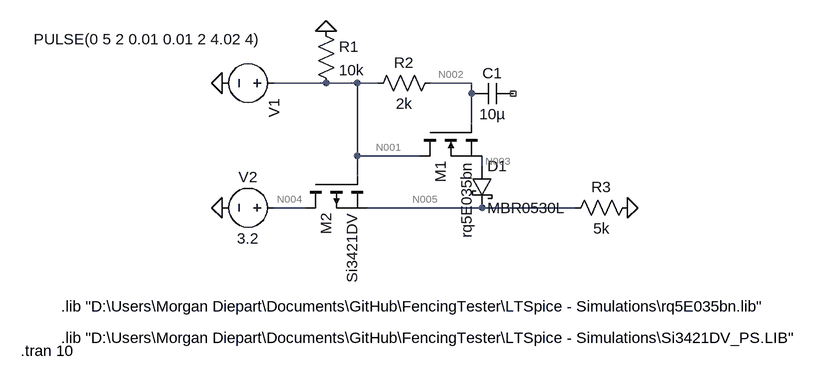
[diagram p0: schematic alim.asc]
alim.asc, the LTspice schematic file:
Version 4
SHEET 1 1172 680
WIRE 320 112 240 112
WIRE 368 112 320 112
WIRE 400 112 368 112
WIRE 544 112 480 112
WIRE 544 128 544 112
WIRE 544 176 544 128
WIRE 368 224 368 112
WIRE 464 224 368 224
WIRE 560 240 560 224
WIRE 368 256 368 224
WIRE 288 304 240 304
WIRE 560 304 384 304
WIRE 704 304 560 304
FLAG 160 112 0
FLAG 320 32 0
FLAG 160 304 0
FLAG 784 304 0
SYMBOL voltage 256 112 R90
WINDOW 3 -68 35 VRight 2
WINDOW 123 0 0 Left 0
WINDOW 39 0 0 Left 0
SYMATTR InstName V1
SYMATTR Value PULSE(0 5 2 0.01 0.01 2 4.02 4)
SYMBOL res 304 16 R0
SYMATTR InstName R1
SYMATTR Value 10k
SYMBOL res 496 96 R90
WINDOW 0 0 56 VBottom 2
WINDOW 3 32 56 VTop 2
SYMATTR InstName R2
SYMATTR Value 2k
SYMBOL cap 608 112 R90
WINDOW 0 0 32 VBottom 2
WINDOW 3 32 32 VTop 2
SYMATTR InstName C1
SYMATTR Value 10µ
SYMBOL nmos 464 176 M90
SYMATTR InstName M1
SYMATTR Value rq5E035bn
SYMATTR Prefix X
SYMBOL pmos 288 256 M90
SYMATTR InstName M2
SYMATTR Value Si3421DV
SYMATTR Prefix X
SYMBOL schottky 544 240 R0
SYMATTR InstName D1
SYMATTR Value MBR0530L
SYMATTR Description Diode
SYMATTR Type diode
SYMBOL voltage 256 304 R90
WINDOW 0 -32 56 VBottom 2
WINDOW 3 32 56 VTop 2
WINDOW 123 0 0 Left 0
WINDOW 39 0 0 Left 0
SYMATTR InstName V2
SYMATTR Value 3.2
SYMBOL res 800 288 R90
WINDOW 0 0 56 VBottom 2
WINDOW 3 32 56 VTop 2
SYMATTR InstName R3
SYMATTR Value 5k
TEXT -88 456 Left 2 !.lib "D:\\Users\\Morgan Diepart\\Documents\\GitHub\\FencingTester\\LTSpice - Simulations\\rq5E035bn.lib"
TEXT -88 504 Left 2 !.lib "D:\\Users\\Morgan Diepart\\Documents\\GitHub\\FencingTester\\LTSpice - Simulations\\Si3421DV_PS.LIB"
TEXT -150 524 Left 2 !.tran 10

The netlist it stands for:
* alim.asc
V1 N001 0 PULSE(0 5 2 0.01 0.01 2 4.02 4)
R1 0 N001 10k
R2 N002 N001 2k
C1 NC_01 N002 10µ
XM1 N001 N002 N003 rq5E035bn  ; pins D G S
XM2 N004 N001 N005 Si3421DV  ; pins D G S
D1 N003 N005 MBR0530L
V2 N004 0 3.2
R3 0 N005 5k
.model D D
.lib standard.dio
.lib "D:\Users\Morgan Diepart\Documents\GitHub\FencingTester\LTSpice - Simulations\rq5E035bn.lib"
.lib "D:\Users\Morgan Diepart\Documents\GitHub\FencingTester\LTSpice - Simulations\Si3421DV_PS.LIB"
.tran 10
.backanno
.end

* Results of the author's LTspice run, read from the files saved beside the schematic
* Operating Point, zero values left out:
*   V(n003) = 405.6 mV
*   V(n005) = 3.2 V
*   V(n004) = 3.2 V
*   I(D1) = -1.55 µA
*   I(R3) = -640 µA
*   I(V2) = -641.5 µA
*   I(V1) = 1.55 µA
*   Ix(m1:1) = -1.55 µA
*   Ix(m1:3) = 1.55 µA
*   Ix(m2:D) = 641.5 µA
*   Ix(m2:S) = -641.5 µA
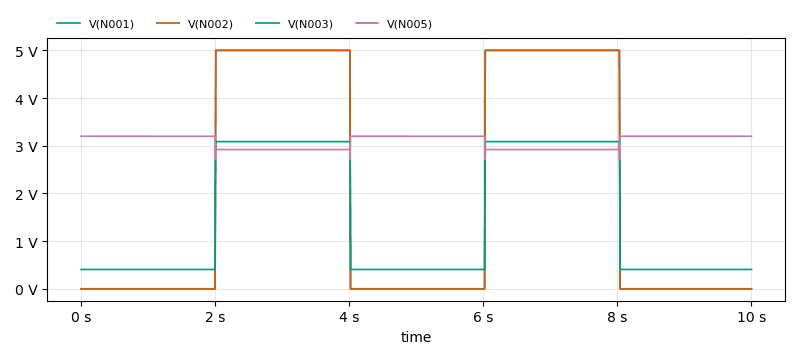
[diagram p1: Transient Analysis of alim.asc, plotted from the saved traces]
* Transient Analysis, 1 run:
*   V(N001): min 0 V, max 5 V, average 2.01 V, rms 3.168 V, last 0 V
*   V(N002): min -6.146 µV, max 5 V, average 2.01 V, rms 3.168 V, last 0 V
*   V(N003): min 405.5 mV, max 3.087 V, average 1.485 V, rms 1.983 V, last 405.6 mV
*   V(N005): min 2.715 V, max 3.2 V, average 3.087 V, rms 3.09 V, last 3.2 V